# Altium schematic sheet uP.SchDoc: =VariantName
size 274 x 177 mm; SheetNumber: 4; SheetTotal: 7
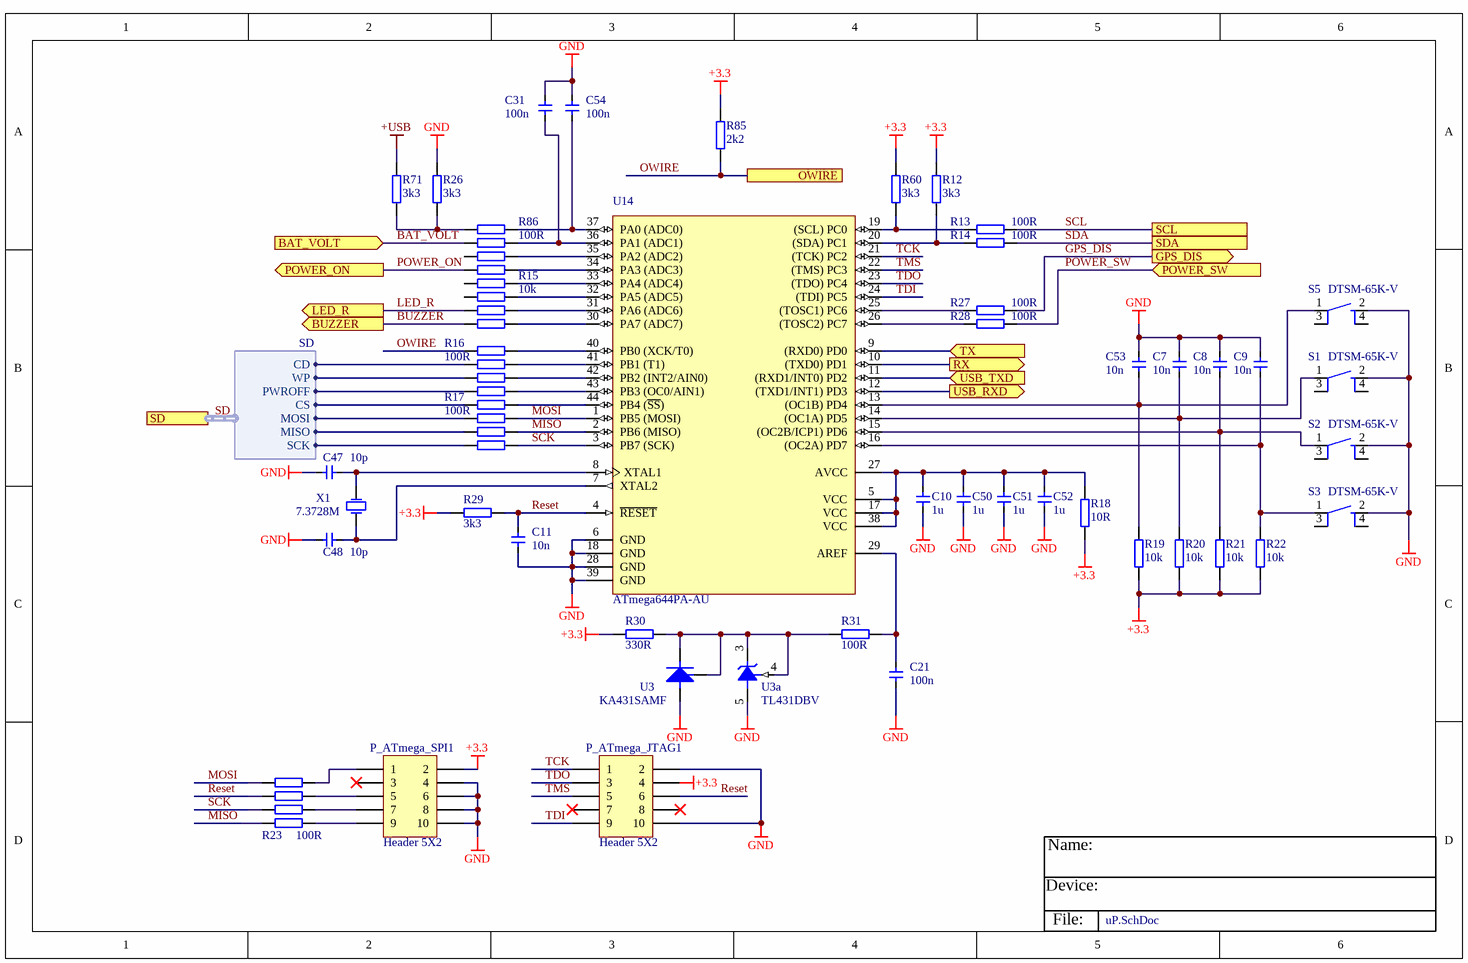
[diagram p0: uP.SchDoc]

## Parts
C7  10n  [C0805]
C8  10n  [C0805]
C9  10n  [C0805]
C10  1u  [C0805]
C11  10n  [C0805]
C21  100n  [C0805]
C31  100n  [C0805]
C47  10p  [C0805]
C48  10p  [C0805]
C50  1u  [C0805]
C51  1u  [C0805]
C52  1u  [C0805]
C53  10n  [C0805]
C54  100n  [C0805]
P_ATmega_JTAG1  Header 5X2  [HDR2X5]
P_ATmega_SPI1  Header 5X2  [HDR2X5]
R12  3k3  [R0805]
R13  100R  [R0805]
R14  100R  [R0805]
R15  10k  [YC164]
R16  100R  [YC164]
R17  100R  [YC164]
R18  10R  [R0805]
R19  10k  [R0805]
R20  10k  [R0805]
R21  10k  [R0805]
R22  10k  [R0805]
R23  100R  [YC164]
R26  3k3  [R0805]
R27  100R  [R0805]
R28  100R  [R0805]
R29  3k3  [R0805]
R30  330R  [R0805]
R31  100R  [R0805]
R60  3k3  [R0805]
R71  3k3  [R0805]
R85  2k2  [R0805]
R86  100R  [YC164]
S1  DTSM-65K-V  [DTSM-65K-V]
S2  DTSM-65K-V  [DTSM-65K-V]
S3  DTSM-65K-V  [DTSM-65K-V]
S5  DTSM-65K-V  [DTSM-65K-V]
U3  KA431SAMF  [SOT23-3]
U3a  TL431DBV  [DBV_R-PDSO-G5]
U14  ATmega644PA-AU  [44A_M]
X1  7.3728M  [HC-49SM]

## Ports
BAT_VOLT (in), BUZZER (out), GPS_DIS (out), LED_R (out), OWIRE, POWER_ON (out), POWER_SW (in), RX (out), SCL, SD (harness SD), SDA, TX (in), USB_RXD (out), USB_TXD (in)

## Harnesses
SD: PWROFF, CD, WP, CS, MOSI, MISO, SCK

## Nets
+3.3: P_ATmega_JTAG1.4 P_ATmega_SPI1.2 R12.2 R18.1 R19.1 R20.1 R21.1 R22.1 R29.1 R30.2 R60.2 R85.2
+USB: R71.2
GND: C7.2 C8.2 C9.2 C10.1 C11.1 C21.1 C31.2 C47.1 C48.1 C50.1 C51.1 C52.1 C53.2 C54.2 P_ATmega_JTAG1.2 P_ATmega_JTAG1.10 P_ATmega_SPI1.4 P_ATmega_SPI1.6 P_ATmega_SPI1.8 P_ATmega_SPI1.10 R26.2 S1.2(S1) S2.2(S1) S3.2(S1) S5.2(S1) U3.3(A) U3a.5(A) U14.6(GND) U14.18(GND) U14.28(GND) U14.39(GND)
BAT_VOLT: R86.3 ; port BAT_VOLT
BUZZER: R15.1 ; port BUZZER
GPS_DIS: R27.1 ; port GPS_DIS
LED_R: R15.2 ; port LED_R
MISO: R17.6 R23.4 U14.2(PB6_(MISO))
MOSI: R17.7 R23.1 U14.1(PB5_(MOSI))
OWIRE: R16.1 R85.1 ; port OWIRE
POWER_ON: R86.1 ; port POWER_ON
POWER_SW: R28.1 ; port POWER_SW
Reset: C11.2 P_ATmega_JTAG1.6 R23.2 R29.2 U14.4(~{RESET})
RX: U14.10((TXD0)_PD1) ; port RX
SCK: R17.5 R23.3 U14.3(PB7_(SCK))
SCL: R13.1 ; port SCL
SD.CD: R16.2 ; port SD.CD
SD.CS: R17.1 ; port SD.CS
SD.MISO: R17.3 ; port SD.MISO
SD.MOSI: R17.2 ; port SD.MOSI
SD.PWROFF: R16.4 ; port SD.PWROFF
SD.SCK: R17.4 ; port SD.SCK
SD.WP: R16.3 ; port SD.WP
SDA: R14.1 ; port SDA
TCK: P_ATmega_JTAG1.1 U14.21((TCK)_PC2)
TDI: P_ATmega_JTAG1.9 U14.24((TDI)_PC5)
TDO: P_ATmega_JTAG1.3 U14.23((TDO)_PC4)
TMS: P_ATmega_JTAG1.5 U14.22((TMS)_PC3)
TX: U14.9((RXD0)_PD0) ; port TX
USB_RXD: U14.12((TXD1/INT1)_PD3) ; port USB_RXD
USB_TXD: U14.11((RXD1/INT0)_PD2) ; port USB_TXD
NetC7_1: C7.1 R20.2 S1.1(P1) U14.14((OC1A)_PD5)
NetC8_1: C8.1 R21.2 S2.1(P1) U14.15((OC2B/ICP1)_PD6)
NetC9_1: C9.1 R22.2 S3.1(P1) U14.16((OC2A)_PD7)
NetC10_2: C10.2 C50.2 C51.2 C52.2 R18.2 U14.5(VCC) U14.17(VCC) U14.27(AVCC) U14.38(VCC)
NetC21_2: C21.2 R31.1 U14.29(AREF)
NetC31_1: C31.1 R86.6 U14.36(PA1_(ADC1))
NetC47_2: C47.2 U14.8(XTAL1) X1.2(OSC2)
NetC48_2: C48.2 U14.7(XTAL2) X1.1(OSC1)
NetC53_1: C53.1 R19.2 S5.1(P1) U14.13((OC1B)_PD4)
NetC54_1: C54.1 R86.5 U14.37(PA0_(ADC0))
NetP_ATmega_SPI1_1: P_ATmega_SPI1.1 R23.8
NetP_ATmega_SPI1_5: P_ATmega_SPI1.5 R23.7
NetP_ATmega_SPI1_7: P_ATmega_SPI1.7 R23.6
NetP_ATmega_SPI1_9: P_ATmega_SPI1.9 R23.5
NetR12_1: R12.1 R14.2 U14.20((SDA)_PC1)
NetR13_2: R13.2 R60.1 U14.19((SCL)_PC0)
NetR15_5: R15.5 U14.33(PA4_(ADC4))
NetR15_6: R15.6 U14.32(PA5_(ADC5))
NetR15_7: R15.7 U14.31(PA6_(ADC6))
NetR15_8: R15.8 U14.30(PA7_(ADC7))
NetR16_5: R16.5 U14.43(PB3_(OC0/AIN1))
NetR16_6: R16.6 U14.42(PB2_(INT2/AIN0))
NetR16_7: R16.7 U14.41(PB1_(T1))
NetR16_8: R16.8 U14.40(PB0_(XCK/T0))
NetR17_8: R17.8 U14.44(PB4_(~{SS}))
NetR26_1: R26.1 R71.1 R86.4
NetR27_2: R27.2 U14.25((TOSC1)_PC6)
NetR28_2: R28.2 U14.26((TOSC2)_PC7)
NetR30_1: R30.1 R31.2 U3.1(K) U3.2(R) U3a.3(K) U3a.4(REF)
NetR86_7: R86.7 U14.35(PA2_(ADC2))
NetR86_8: R86.8 U14.34(PA3_(ADC3))

Not connected (* = marked no-connect by the designer): P_ATmega_JTAG1 7* 8*; P_ATmega_SPI1 3*; R15 3 4; R86 2; S1 3(P2) 4(2); S2 3(P2) 4(2); S3 3(P2) 4(2); S5 3(P2) 4(2)

## Buses and harness runs
harness SD = port SD

## Notes on the sheet
- Name:
- Device:
- File:

## Library data of the parts
C7-C9 C11 C53 = c: C; capacitor; Indeks: MKOS0603057; P&P: 1; Value: 10n
C10 C50-C52 = c: C; capacitor; Indeks: MKOS0603021; P&P: 1; Value: 1u
C21 C31 C54 = c: C; capacitor; Indeks: MKOS0603002; P&P: 1; Value: 100n
C47 C48 = c: C; capacitor; Indeks: MKOS0603039; P&P: 1; Value: 10p
P_ATmega_JTAG1 P_ATmega_SPI1 = Header 5X2: Header, 5-Pin, Dual row; Indeks: MZLMP002; P&P: 0; LatestRevisionDate: 17-Jul-2002; LatestRevisionNote: Re-released for DXP Platform.; Publisher: Altium Limited
R12-R14 R18 R26-R29 R60 R71 = R: R; resistor; Indeks: MRESR0603091; P&P: 1
  R12 R26 R29 R60 R71: Value: 3k3
  R13 R14 R27 R28: Value: 100R
  R18: Value: 10R
R15-R17 R23 R86 = YC164: R; Drabinka rezystorowa; Indeks: MRESD4D03003; P&P: 1
  R15: Value: 10k
  R16 R17 R23 R86: Value: 100R
R19-R22 R30 R31 = R: R; resistor; Indeks: *; P&P: *
  R19-R22: Value: 10k
  R30: Value: 330R
  R31: Value: 100R
R85 = R: R; resistor; Indeks: MRESR0603112; P&P: 1; Value: 2k2
S1-S3 S5 = DTSM-65K-V: SWITCH; TACT switch, 6x6, h=9.5mm; Indeks: MPLSM008; P&P: 1; Value: DTSM-65K-V
U3 = KA431SAMF: REF; SOT23; Fairchild; Indeks: MUKSM038; P&P: 1; Value: KA431SAMF; Obudowa: SOT23
U3a = TL431DBV: Adjustable Precision Shunt Regulator; Indeks: MUKSA180; P&P: 1; ComponentLink1Description: Manufacturer Link; ComponentLink1URL: http://www.ti.com/; ComponentLink2Description: Datasheet; ComponentLink2URL: http://www-s.ti.com/sc/ds/tl431a.pdf; Value: TL431DBV
U14 = ATmega644PA: P&P: 1; Indeks: MUKSC1065; Rule: UNIONINDEX{}0[]RULEKIND{}Clearance[]NETSCOPE{}DifferentNets[]LAYERKIND{}SameLayer[]NAME{}Schematic Clearance Constraint[]GAP{}7.874mil[]GENERICCLEARANCE{}7.874mil[]OBJECTCLEARANCES{} []UNIT{}Metric[]PcbType{}ProtelPcb; PackageReference: 44A; PackageDescription: 44-Pin Plastic Thin Profile Quad Flat Pack, 10 x 10 x 1.0 mm Body, 0.8 mm Pitch (TQFP); Value: ATmega644PA-AU
X1 = XTAL: OSC_Q; Crystal Oscillator; Indeks: MRZS052; P&P: 0; Value: 7.3728M